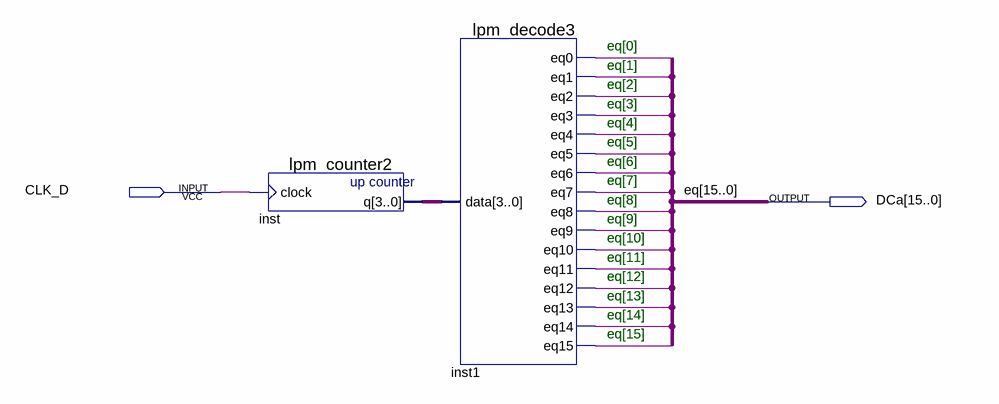
[diagram p0: schematic sheet]
// Quartus schematic lab2block3.bdf as structural Verilog: 2 symbols, 2 pins
module lab2block3 (
  input  CLK_D,
  output [15:0] DCa
);

  wire [3:0] inst_q;

  lpm_counter2 inst (.clock(CLK_D), .q(inst_q));
  lpm_decode3 inst1 (
    .data(inst_q), .eq0(DCa[0]), .eq1(DCa[1]), .eq2(DCa[2]), .eq3(DCa[3]), .eq4(DCa[4]), .eq5(DCa[5]),
    .eq6(DCa[6]), .eq7(DCa[7]), .eq8(DCa[8]), .eq9(DCa[9]), .eq10(DCa[10]), .eq11(DCa[11]), .eq12(DCa[12]),
    .eq13(DCa[13]), .eq14(DCa[14]), .eq15(DCa[15]));

  // Other names for the same wires on the sheet: eq[15:0] = DCa

  // Notes on the sheet:
  //   eq[0]
  //   eq[1]
  //   eq[2]
  //   eq[3]
  //   eq[4]
  //   eq[5]
  //   eq[6]
  //   eq[7]
  //   eq[8]
  //   eq[9]
  //   eq[10]
  //   eq[11]
  //   eq[12]
  //   eq[13]
  //   eq[14]
  //   eq[15]
endmodule
